# EAGLE schematic ESP WS2812B PANELS (EAGLE 9.6.2)
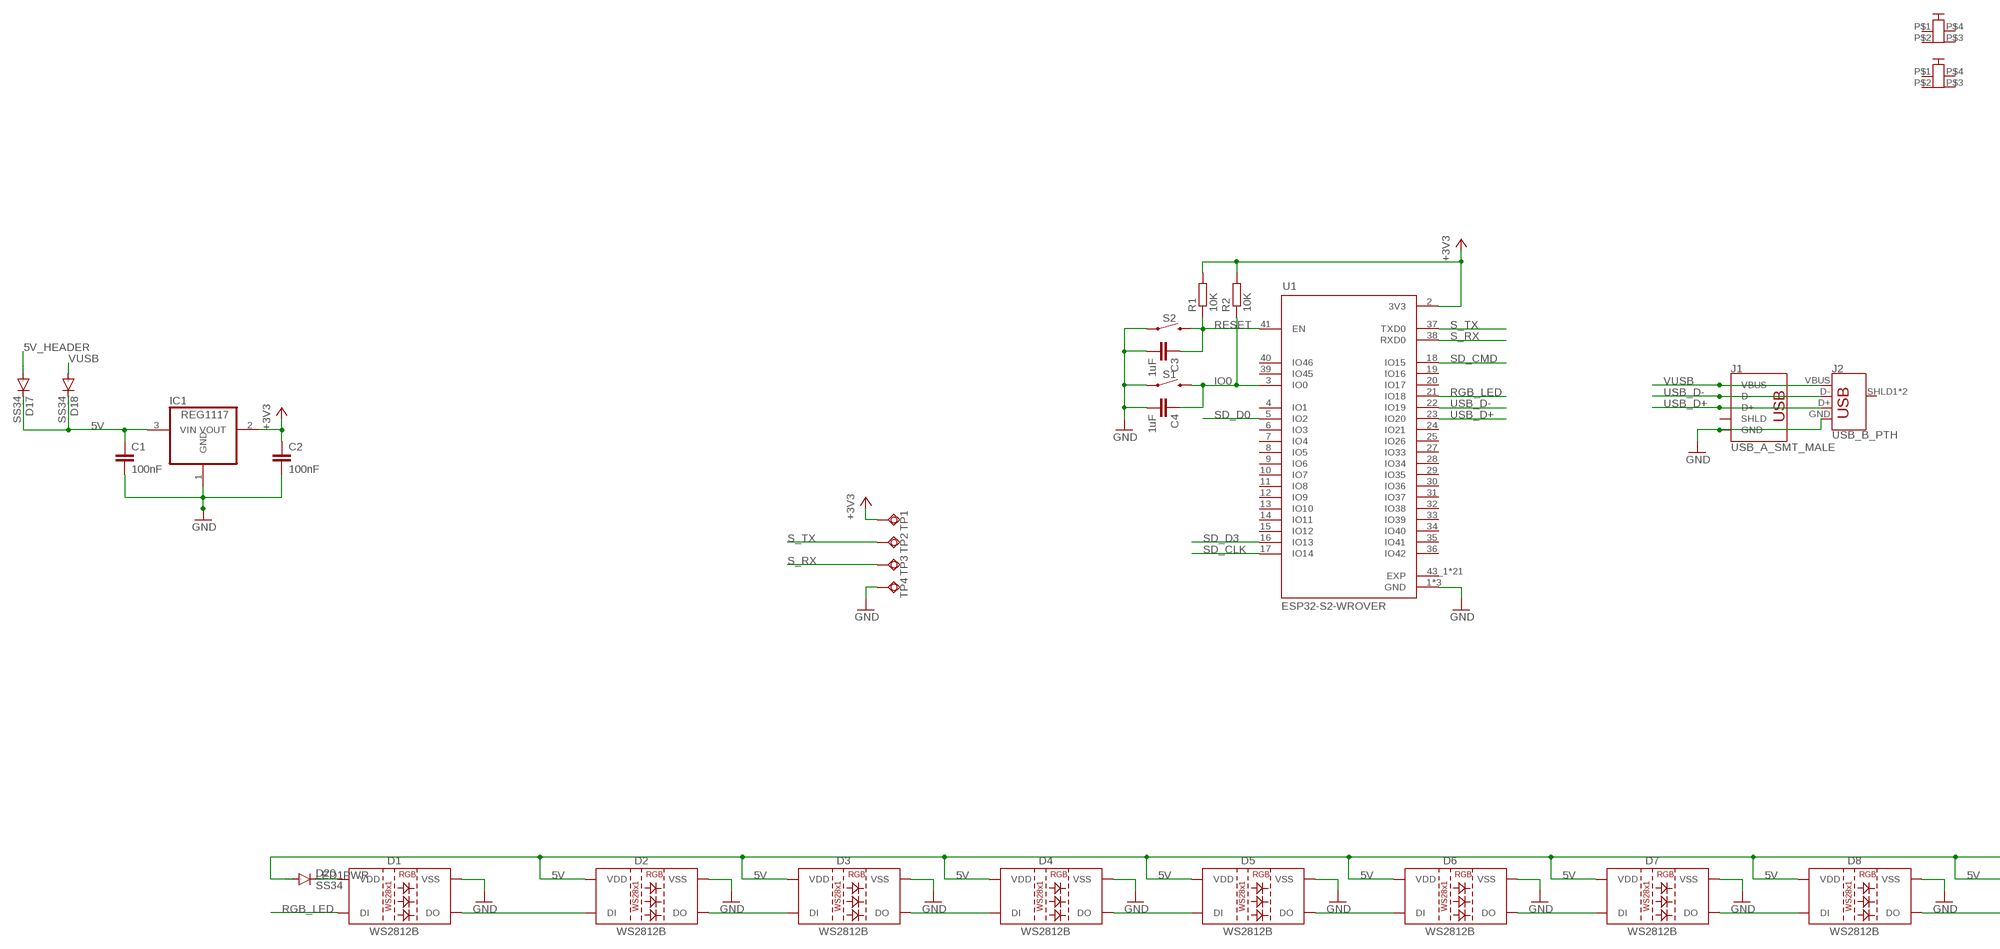
[diagram p0: schematic, sheet 1, part 1 of 2]
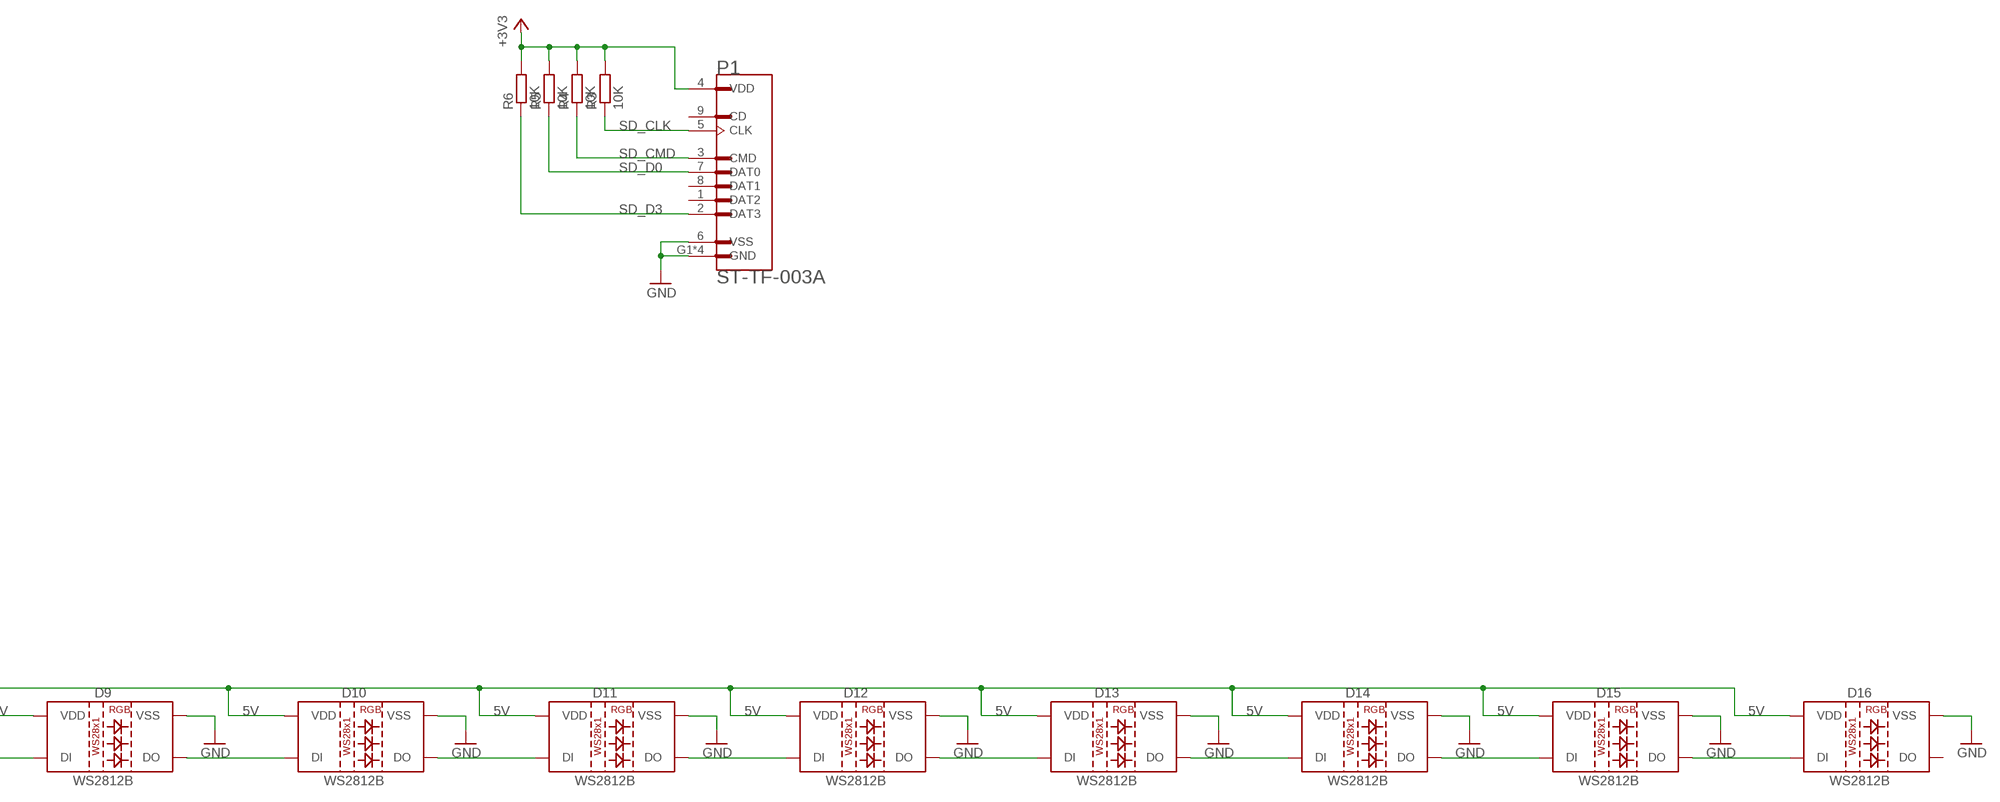
[diagram p1: schematic, sheet 1, part 2 of 2]

## Parts
C1  100nF  C-EUC0805  [C0805]
C2  100nF  C-EUC1206  [C1206]
C3  1uF  C-EUC1206  [C1206]
C4  1uF  C-EUC1206  [C1206]
CON4  PCB-2M3  [PCB2-M3]
CON8  PCB-2M3  [PCB2-M3]
D1  WS2812B  [WS2812B]
D2  WS2812B  [WS2812B]
D3  WS2812B  [WS2812B]
D4  WS2812B  [WS2812B]
D5  WS2812B  [WS2812B]
D6  WS2812B  [WS2812B]
D7  WS2812B  [WS2812B]
D8  WS2812B  [WS2812B]
D9  WS2812B  [WS2812B]
D10  WS2812B  [WS2812B]
D11  WS2812B  [WS2812B]
D12  WS2812B  [WS2812B]
D13  WS2812B  [WS2812B]
D14  WS2812B  [WS2812B]
D15  WS2812B  [WS2812B]
D16  WS2812B  [WS2812B]
D17  SS34  DIODE-DO-214AC  [DO-214AC]
D18  SS34  DIODE-DO-214AC  [DO-214AC]
D20  SS34  DIODE-DO-214AC  [DO-214AC]
IC1  REG1117  [SOT223]
J1  USB_A_SMT_MALE  [USB-A-SMT-MALE]
J2  USB_B_PTH  [USB-B-PTH]
P1  ST-TF-003A  [SUNTECH_ST-TF-003A]
R1  10K  R-EU_R1206  [R1206]
R2  10K  R-EU_R0603  [R0603]
R3  10K  R-EU_R1206  [R1206]
R4  10K  R-EU_R1206  [R1206]
R5  10K  R-EU_R1206  [R1206]
R6  10K  R-EU_R1206  [R1206]
S1  MOMENTARY-SWITCH-SPST-PTH-6.0MM  [TACTILE_SWITCH_PTH_6.0MM]
S2  MOMENTARY-SWITCH-SPST-PTH-6.0MM  [TACTILE_SWITCH_PTH_6.0MM]
TP1  TPSQTP15R  [TP15R]
TP2  TPSQTP15R  [TP15R]
TP3  TPSQTP15R  [TP15R]
TP4  TPSQTP15R  [TP15R]
U1  ESP32-S2-WROVER  [MODULE_ESP32-S2-WROVER]

## Nets
5V: C1.1 D2.1(VDD) D3.1(VDD) D4.1(VDD) D5.1(VDD) D6.1(VDD) D7.1(VDD) D8.1(VDD) D9.1(VDD) D10.1(VDD) D11.1(VDD) D12.1(VDD) D13.1(VDD) D14.1(VDD) D15.1(VDD) D16.1(VDD) D17.C D18.C D20.A IC1.3(VIN)
5V_HEADER: D17.A
+3V3: C2.1 IC1.2(VOUT) P1.4(VDD) R1.2 R2.2 R3.2 R4.2 R5.2 R6.2 TP1.TP U1.2(3V3)
GND: C1.2 C2.2 C3.2 C4.2 D1.3(VSS) D2.3(VSS) D3.3(VSS) D4.3(VSS) D5.3(VSS) D6.3(VSS) D7.3(VSS) D8.3(VSS) D9.3(VSS) D10.3(VSS) D11.3(VSS) D12.3(VSS) D13.3(VSS) D14.3(VSS) D15.3(VSS) D16.3(VSS) IC1.1(GND) J1.GND1(GND) J2.GND P1.6(VSS) P1.G1(GND) P1.G2(GND) P1.G3(GND) P1.G4(GND) S1.1 S2.1 TP4.TP U1.1(GND) U1.26(GND) U1.42(GND)
IO0: C4.1 R2.1 S1.3 U1.3(IO0)
LED1PWR: D1.1(VDD) D20.C
N$3: D15.2(DO) D16.4(DI)
N$4: D14.2(DO) D15.4(DI)
N$5: D13.2(DO) D14.4(DI)
N$8: D12.2(DO) D13.4(DI)
N$9: D11.2(DO) D12.4(DI)
N$10: D10.2(DO) D11.4(DI)
N$11: D9.2(DO) D10.4(DI)
N$12: D8.2(DO) D9.4(DI)
N$13: D7.2(DO) D8.4(DI)
N$14: D6.2(DO) D7.4(DI)
N$15: D5.2(DO) D6.4(DI)
N$16: D4.2(DO) D5.4(DI)
N$17: D3.2(DO) D4.4(DI)
N$18: D2.2(DO) D3.4(DI)
N$19: D1.2(DO) D2.4(DI)
RESET: C3.1 R1.1 S2.3 U1.41(EN)
RGB_LED: D1.4(DI) U1.21(IO18)
S_RX: TP3.TP U1.38(RXD0)
S_TX: TP2.TP U1.37(TXD0)
SD_CLK: P1.5(CLK) R3.1 U1.17(IO14)
SD_CMD: P1.3(CMD) R4.1 U1.18(IO15)
SD_D0: P1.7(DAT0) R5.1 U1.5(IO2)
SD_D3: P1.2(DAT3) R6.1 U1.16(IO13)
USB_D+: J1.D+1(D+) J2.D+ U1.23(IO20)
USB_D-: J1.D-1(D-) J2.D- U1.22(IO19)
VUSB: D18.A J1.VBUS1(VBUS) J2.VBUS
Unconnected: CON4.P$1 CON4.P$2 CON4.P$3 CON4.P$4 CON8.P$1 CON8.P$2 CON8.P$3 CON8.P$4 D16.2(DO) J1.SHLD1(SHLD) J1.SHLD2(SHLD) J2.SHLD1(SHIELD) J2.SHLD2(SHIELD) P1.1(DAT2) P1.8(DAT1) P1.9(CD) U1.4(IO1) U1.6(IO3) U1.7(IO4) U1.8(IO5) U1.9(IO6) U1.10(IO7) U1.11(IO8) U1.12(IO9) U1.13(IO10) U1.14(IO11) U1.15(IO12) U1.19(IO16) U1.20(IO17) U1.24(IO21) U1.25(IO26) U1.27(IO33) U1.28(IO34) U1.29(IO35) U1.30(IO36) U1.31(IO37) U1.32(IO38) U1.33(IO39) U1.34(IO40) U1.35(IO41) U1.36(IO42) U1.39(IO45) U1.40(IO46)

## Power pins joined to a net without a drawn wire
EXP: U1.43_1(EXP) U1.43_2(EXP) U1.43_3(EXP) U1.43_4(EXP) U1.43_5(EXP) U1.43_6(EXP) U1.43_7(EXP) U1.43_8(EXP) U1.43_9(EXP) U1.43_10(EXP) U1.43_11(EXP) U1.43_12(EXP) U1.43_13(EXP) U1.43_14(EXP) U1.43_15(EXP) U1.43_16(EXP) U1.43_17(EXP) U1.43_18(EXP) U1.43_19(EXP) U1.43_20(EXP) U1.43_21(EXP)

## Library data of the parts
C1-C4 = rcl:C-EU: CAPACITOR, European symbol; SPICEPREFIX: C
CON4 CON8 = Screw Terminals:PCB-2M3
D1-D16 = SparkFun-LED:WS2812B: WS2812B SMD addressable RGB LED 5x5mm SMD LED with built-in controller IC. Color: Red/Green/Blue mC Rating: RGB: 390, 660, 180 mcd Forward Voltage: RGB: 2.0, 3.0, 3.0 V Packages:WS2812B SparkFun Products: Blynk Board - ESP8266 <https://www.sparkfun.com/products/13794>; PROD_ID: DIO-12503
D17 D18 D20 = diode:DIODE-: DIODE
IC1 = burr-brown:REG1117: 800mA and 1A Low Dropout (LDO) Positive Regulator 1.8V, 2.5V, 2.85V, 3.3V, 5V, and Adj; MPN: REG1117; OC_FARNELL: 1097566; OC_NEWARK: 14P6981
J1 = SparkFun-Connectors:USB_A: USB-A Connector Male and female variants, as well as PTH and SMT variants SparkFun Products: SparkFun XBee Explorer Dongle <https://www.sparkfun.com/products/11697> PTH Male SparkFun MicroView-USB Programmer <https://www.sparkfun.com/products/12924> SMT Male SparkFun USB Type A Female Breakout <https://www.sparkfun.com/products/12700> SMT Female; PROD_ID: CONN-11499
J2 = SparkFun-Connectors2:USB_B: USB Type B Connector SparkFun Products: SparkFun Stepoko <https://www.sparkfun.com/products/13899> PTH; PROD_ID: CONN-08278; SF_ID: PRT-00139
P1 = ST-TF-003A:ST-TF-003A: Micro SD Card Socket; AVAILABILITY: Unavailable; DESCRIPTION: Micro SD Card Socket; MF: Suntech; MP: ST-TF-003A; PACKAGE: None; PRICE: None
R1-R6 = rcl:R-EU_: RESISTOR, European symbol; SPICEPREFIX: R
S1 S2 = SparkFun-Switches:MOMENTARY-SWITCH-SPST: Momentary Switch (Pushbutton) - SPST Normally-open (NO) SPST momentary switches (buttons, pushbuttons). Variants PTH-12MM - 12mm square, through-hole Momentary Pushbutton Switch - 12mm Square <https://www.sparkfun.com/products/9190> (COM-09190) PTH-6.0MM, PTH-6.0MM-KIT - 6.0mm square, through-hole Mini Pushbutton Switch <https://www.sparkfun.com/products/97> (COM-00097) KIT package intended for soldering kit's - only one side of pads' copper is exposed. PTH-RIGHT-ANGLE-KIT - Right-angle, through-hole Right Angle Tactile Button <https://www.sparkfun.com/products/10791> - Used on SparkFun BigTime Watch Kit <https://www.sparkfun.com/products/11734> SMD-12MM - 12mm square, surface-mount Tactile Button - SMD (12mm) <https://www.sparkfun.com/products/12993> (COM-12993) Used on SparkFun PicoBoard <https://www.sparkfun.com/products/11888> SMD-4.5MM - 4.5mm Square Trackball Switch Used on SparkFun Blackberry Trackballer Breakout <https://www.sparkfun.com/products/13169> SMD-4.6MMX2.8MM - 4.60mm x 2.80mm, surface mount Used on SparkFun SAMD21 Mini Breakout <https://www.sparkfun.com/products/13664> SMD-5.2MM, SMD-5.2-REDUNDANT - 5.2mm square, surface-mount Mini Pushbutton Switch - SMD <https://www.sparkfun.com/products/8720> (COM-08720) Used on Arduino Pro Mini <https://www.sparkfun.com/products/11114> REDUNDANT package connects both switch circuits together SMD-6.0X3.5MM - 6.0 x 3.5mm, surface mount Momentary Reset Switch SMD <https://www.sparkfun.com/products/8229> (COM-08229) SMD-6.2MM-TALL - 6.2mm square, surface mount Tactile Button - SMD (6mm) <https://www.sparkfun.com/products/12992> Used on SparkFun Digital Sandbox <https://www.sparkfun.com/products/12651> SMD-RIGHT-ANGLE - Right-angle, surface mount Used on SparkFun Block for Intel® Edison - Arduino <https://www.sparkfun.com/products/13036>; PROD_ID: SWCH-08441; SF_SKU: COM-00097
TP1-TP4 = testpad:TPSQ: Test pad
U1 = ESP32-S2-WROVER:ESP32-S2-WROVER: WiFi 802.11b/g/n Transceiver Module 2.4GHz Antenna Not Included Surface Mount Check prices <https://pricing.snapeda.com/parts/ESP32-S2-WROVER/Espressif%20Systems/view-part?ref=eda>; AVAILABILITY: Bad; DESCRIPTION: WiFi 802.11b/g/n Transceiver Module 2.4GHz Antenna Not Included Surface Mount; MF: Espressif Systems; MP: ESP32-S2-WROVER; PACKAGE: VFQFN-56 Espressif Systems; PRICE: None